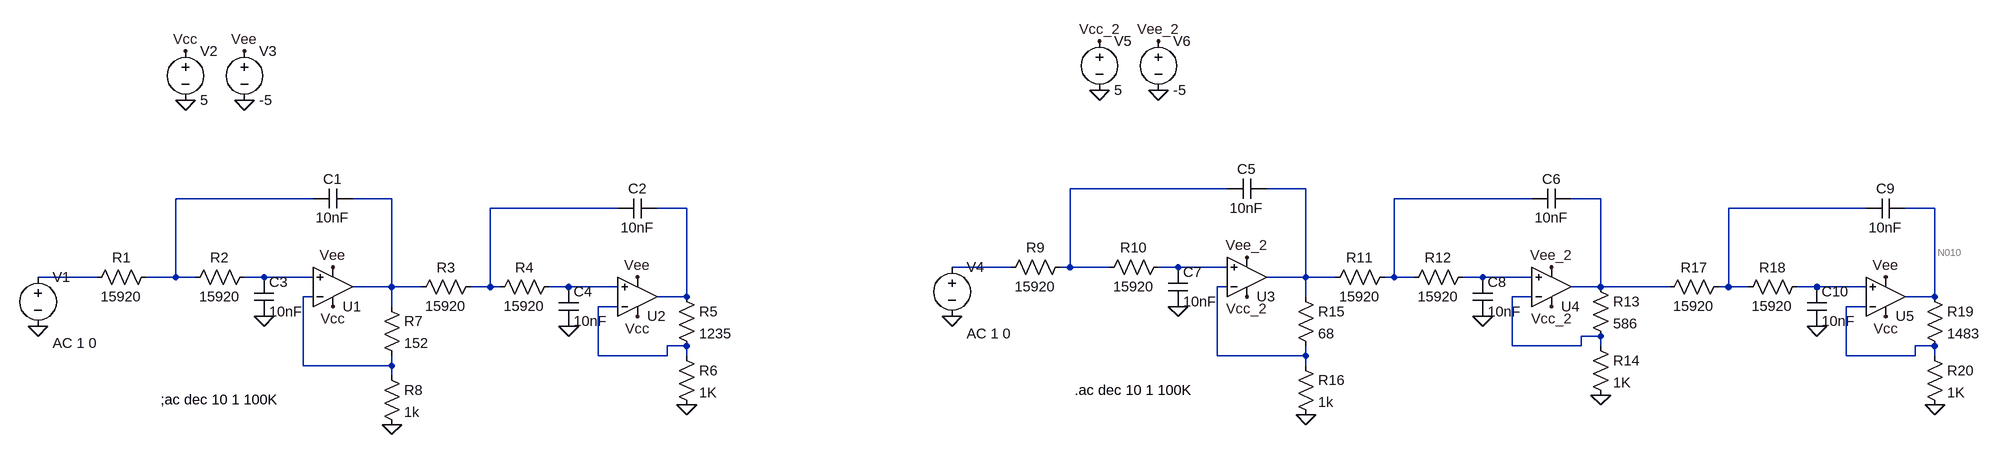
[diagram p0: schematic Ejercicio_6.asc]
Ejercicio_6.asc, the LTspice schematic file:
Version 4
SHEET 1 2724 680
WIRE 1488 -16 1232 -16
WIRE 1616 -16 1552 -16
WIRE 0 0 -224 0
WIRE 128 0 64 0
WIRE 1984 0 1760 0
WIRE 2096 0 2048 0
WIRE 496 16 288 16
WIRE 608 16 560 16
WIRE 2528 16 2304 16
WIRE 2640 16 2592 16
WIRE 1136 112 1040 112
WIRE 1232 112 1232 -16
WIRE 1232 112 1216 112
WIRE 1296 112 1232 112
WIRE 1408 112 1376 112
WIRE 1488 112 1408 112
WIRE -352 128 -448 128
WIRE -224 128 -224 0
WIRE -224 128 -272 128
WIRE -192 128 -224 128
WIRE -80 128 -112 128
WIRE 0 128 -80 128
WIRE 1616 128 1616 -16
WIRE 1616 128 1552 128
WIRE 1664 128 1616 128
WIRE 1760 128 1760 0
WIRE 1760 128 1744 128
WIRE 1792 128 1760 128
WIRE 1904 128 1872 128
WIRE 1984 128 1904 128
WIRE 128 144 128 0
WIRE 128 144 64 144
WIRE 176 144 128 144
WIRE 288 144 288 16
WIRE 288 144 256 144
WIRE 304 144 288 144
WIRE 416 144 384 144
WIRE 496 144 416 144
WIRE 1488 144 1472 144
WIRE 2096 144 2096 0
WIRE 2096 144 2048 144
WIRE 2208 144 2096 144
WIRE 2304 144 2304 16
WIRE 2304 144 2288 144
WIRE 2336 144 2304 144
WIRE 2448 144 2416 144
WIRE 2528 144 2448 144
WIRE 0 160 -16 160
WIRE 608 160 608 16
WIRE 608 160 560 160
WIRE 1616 160 1616 128
WIRE 1984 160 1952 160
WIRE 2640 160 2640 16
WIRE 2640 160 2592 160
WIRE 128 176 128 144
WIRE 496 176 464 176
WIRE 2528 176 2496 176
WIRE 2096 224 2064 224
WIRE 608 240 576 240
WIRE 1952 240 1952 160
WIRE 2064 240 2064 224
WIRE 2064 240 1952 240
WIRE 2096 240 2096 224
WIRE 2640 240 2608 240
WIRE 464 256 464 176
WIRE 576 256 576 240
WIRE 576 256 464 256
WIRE 608 256 608 240
WIRE 1472 256 1472 144
WIRE 1616 256 1616 240
WIRE 1616 256 1472 256
WIRE 2496 256 2496 176
WIRE 2608 256 2608 240
WIRE 2608 256 2496 256
WIRE 2640 256 2640 240
WIRE -16 272 -16 160
WIRE 128 272 128 256
WIRE 128 272 -16 272
WIRE 1616 272 1616 256
WIRE 128 288 128 272
FLAG -80 192 0
FLAG 416 208 0
FLAG 608 336 0
FLAG -208 -160 0
FLAG -112 -160 0
FLAG -208 -240 Vcc
FLAG -112 -240 Vee
FLAG 32 176 Vcc
FLAG 528 192 Vcc
FLAG 32 112 Vee
FLAG 528 128 Vee
FLAG -448 208 0
FLAG 128 368 0
FLAG 1408 176 0
FLAG 1904 192 0
FLAG 2096 320 0
FLAG 1280 -176 0
FLAG 1376 -176 0
FLAG 1280 -256 Vcc_2
FLAG 1376 -256 Vee_2
FLAG 1520 160 Vcc_2
FLAG 2016 176 Vcc_2
FLAG 1520 96 Vee_2
FLAG 2016 112 Vee_2
FLAG 1040 192 0
FLAG 1616 352 0
FLAG 2448 208 0
FLAG 2640 336 0
FLAG 2560 192 Vcc
FLAG 2560 128 Vee
SYMBOL OpAmps\\UniversalOpAmp 32 144 M180
SYMATTR InstName U1
SYMBOL OpAmps\\UniversalOpAmp 528 160 M180
SYMATTR InstName U2
SYMBOL cap 64 -16 R90
WINDOW 0 0 32 VBottom 2
WINDOW 3 32 32 VTop 2
SYMATTR InstName C1
SYMATTR Value 10nF
SYMBOL cap 560 0 R90
WINDOW 0 0 32 VBottom 2
WINDOW 3 32 32 VTop 2
SYMATTR InstName C2
SYMATTR Value 10nF
SYMBOL res -256 112 R90
WINDOW 0 0 56 VBottom 2
WINDOW 3 32 56 VTop 2
SYMATTR InstName R1
SYMATTR Value 15920
SYMBOL res -96 112 R90
WINDOW 0 0 56 VBottom 2
WINDOW 3 32 56 VTop 2
SYMATTR InstName R2
SYMATTR Value 15920
SYMBOL cap -96 128 R0
SYMATTR InstName C3
SYMATTR Value 10nF
SYMBOL res 272 128 R90
WINDOW 0 0 56 VBottom 2
WINDOW 3 32 56 VTop 2
SYMATTR InstName R3
SYMATTR Value 15920
SYMBOL res 400 128 R90
WINDOW 0 0 56 VBottom 2
WINDOW 3 32 56 VTop 2
SYMATTR InstName R4
SYMATTR Value 15920
SYMBOL cap 400 144 R0
SYMATTR InstName C4
SYMATTR Value 10nF
SYMBOL res 592 144 R0
SYMATTR InstName R5
SYMATTR Value 1235
SYMBOL res 592 240 R0
SYMATTR InstName R6
SYMATTR Value 1K
SYMBOL voltage -448 112 R0
WINDOW 123 24 124 Left 2
WINDOW 39 0 0 Left 0
SYMATTR Value2 AC 1 0
SYMATTR InstName V1
SYMATTR Value ""
SYMBOL voltage -208 -256 R0
WINDOW 123 0 0 Left 0
WINDOW 39 0 0 Left 0
SYMATTR InstName V2
SYMATTR Value 5
SYMBOL voltage -112 -256 R0
WINDOW 123 0 0 Left 0
WINDOW 39 0 0 Left 0
SYMATTR InstName V3
SYMATTR Value -5
SYMBOL res 112 160 R0
SYMATTR InstName R7
SYMATTR Value 152
SYMBOL res 112 272 R0
SYMATTR InstName R8
SYMATTR Value 1k
SYMBOL OpAmps\\UniversalOpAmp 1520 128 M180
SYMATTR InstName U3
SYMBOL OpAmps\\UniversalOpAmp 2016 144 M180
SYMATTR InstName U4
SYMBOL cap 1552 -32 R90
WINDOW 0 0 32 VBottom 2
WINDOW 3 32 32 VTop 2
SYMATTR InstName C5
SYMATTR Value 10nF
SYMBOL cap 2048 -16 R90
WINDOW 0 0 32 VBottom 2
WINDOW 3 32 32 VTop 2
SYMATTR InstName C6
SYMATTR Value 10nF
SYMBOL res 1232 96 R90
WINDOW 0 0 56 VBottom 2
WINDOW 3 32 56 VTop 2
SYMATTR InstName R9
SYMATTR Value 15920
SYMBOL res 1392 96 R90
WINDOW 0 0 56 VBottom 2
WINDOW 3 32 56 VTop 2
SYMATTR InstName R10
SYMATTR Value 15920
SYMBOL cap 1392 112 R0
SYMATTR InstName C7
SYMATTR Value 10nF
SYMBOL res 1760 112 R90
WINDOW 0 0 56 VBottom 2
WINDOW 3 32 56 VTop 2
SYMATTR InstName R11
SYMATTR Value 15920
SYMBOL res 1888 112 R90
WINDOW 0 0 56 VBottom 2
WINDOW 3 32 56 VTop 2
SYMATTR InstName R12
SYMATTR Value 15920
SYMBOL cap 1888 128 R0
SYMATTR InstName C8
SYMATTR Value 10nF
SYMBOL res 2080 128 R0
SYMATTR InstName R13
SYMATTR Value 586
SYMBOL res 2080 224 R0
SYMATTR InstName R14
SYMATTR Value 1K
SYMBOL voltage 1040 96 R0
WINDOW 123 24 124 Left 2
WINDOW 39 0 0 Left 0
SYMATTR Value2 AC 1 0
SYMATTR InstName V4
SYMATTR Value ""
SYMBOL voltage 1280 -272 R0
WINDOW 123 0 0 Left 0
WINDOW 39 0 0 Left 0
SYMATTR InstName V5
SYMATTR Value 5
SYMBOL voltage 1376 -272 R0
WINDOW 123 0 0 Left 0
WINDOW 39 0 0 Left 0
SYMATTR InstName V6
SYMATTR Value -5
SYMBOL res 1600 144 R0
SYMATTR InstName R15
SYMATTR Value 68
SYMBOL res 1600 256 R0
SYMATTR InstName R16
SYMATTR Value 1k
SYMBOL OpAmps\\UniversalOpAmp 2560 160 M180
SYMATTR InstName U5
SYMBOL cap 2592 0 R90
WINDOW 0 0 32 VBottom 2
WINDOW 3 32 32 VTop 2
SYMATTR InstName C9
SYMATTR Value 10nF
SYMBOL res 2304 128 R90
WINDOW 0 0 56 VBottom 2
WINDOW 3 32 56 VTop 2
SYMATTR InstName R17
SYMATTR Value 15920
SYMBOL res 2432 128 R90
WINDOW 0 0 56 VBottom 2
WINDOW 3 32 56 VTop 2
SYMATTR InstName R18
SYMATTR Value 15920
SYMBOL cap 2432 144 R0
SYMATTR InstName C10
SYMATTR Value 10nF
SYMBOL res 2624 144 R0
SYMATTR InstName R19
SYMATTR Value 1483
SYMBOL res 2624 240 R0
SYMATTR InstName R20
SYMATTR Value 1K
TEXT -248 328 Left 2 !;ac dec 10 1 100K
TEXT 1240 312 Left 2 !.ac dec 10 1 100K

The netlist it stands for:
* Ejercicio_6.asc
XU1 N014 N019 Vcc Vee N004 level1 Avol=1Meg GBW=10Meg Vos=0 En=0 Enk=0 In=0 Ink=0 Rin=500Meg  ; pins In+ In- V+ V- OUT
XU2 N016 N021 Vcc Vee N008 level1 Avol=1Meg GBW=10Meg Vos=0 En=0 Enk=0 In=0 Ink=0 Rin=500Meg  ; pins In+ In- V+ V- OUT
C1 N004 N003 10nF
C2 N008 N007 10nF
R1 N003 N013 15920
R2 N014 N003 15920
C3 N014 0 10nF
R3 N007 N004 15920
R4 N016 N007 15920
C4 N016 0 10nF
R5 N008 N021 1235
R6 N021 0 1K
V1 N013 0 AC 1 0
V2 Vcc 0 5
V3 Vee 0 -5
R7 N004 N019 152
R8 N019 0 1k
XU3 N012 N017 Vcc_2 Vee_2 N002 level1 Avol=1Meg GBW=10Meg Vos=0 En=0 Enk=0 In=0 Ink=0 Rin=500Meg  ; pins In+ In- V+ V- OUT
XU4 N015 N020 Vcc_2 Vee_2 N006 level1 Avol=1Meg GBW=10Meg Vos=0 En=0 Enk=0 In=0 Ink=0 Rin=500Meg  ; pins In+ In- V+ V- OUT
C5 N002 N001 10nF
C6 N006 N005 10nF
R9 N001 N011 15920
R10 N012 N001 15920
C7 N012 0 10nF
R11 N005 N002 15920
R12 N015 N005 15920
C8 N015 0 10nF
R13 N006 N020 586
R14 N020 0 1K
V4 N011 0 AC 1 0
V5 Vcc_2 0 5
V6 Vee_2 0 -5
R15 N002 N017 68
R16 N017 0 1k
XU5 N018 N022 Vcc Vee N010 level1 Avol=1Meg GBW=10Meg Vos=0 En=0 Enk=0 In=0 Ink=0 Rin=500Meg  ; pins In+ In- V+ V- OUT
C9 N010 N009 10nF
R17 N009 N006 15920
R18 N018 N009 15920
C10 N018 0 10nF
R19 N010 N022 1483
R20 N022 0 1K
;ac dec 10 1 100K
.ac dec 10 1 100K
.lib UniversalOpAmp1.lib
.backanno
.end

* Results of the author's LTspice run, read from the files saved beside the schematic
* Operating Point, zero values left out:
*   V(vcc) = 5 V
*   V(vee) = -5 V
*   V(vcc_2) = 5 V
*   V(vee_2) = -5 V
*   I(V6) = 20 nA
*   I(V5) = -20 nA
*   I(V3) = 30 nA
*   I(V2) = -30 nA
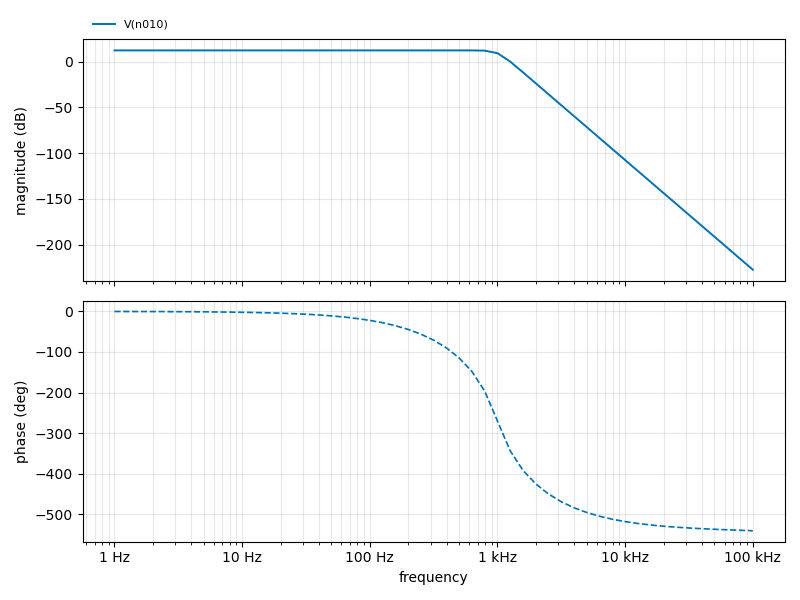
[diagram p1: AC Analysis of Ejercicio_6.asc, plotted from the saved traces]
* AC Analysis, 1 run:
*   V(n010): 12.48 dB at 1 Hz, -227.55 dB at 100 kHz, peak 12.48 dB at 501.2 Hz, 3 dB below the peak at 1 kHz